# Altium schematic sheet DI.SchDoc
size A4
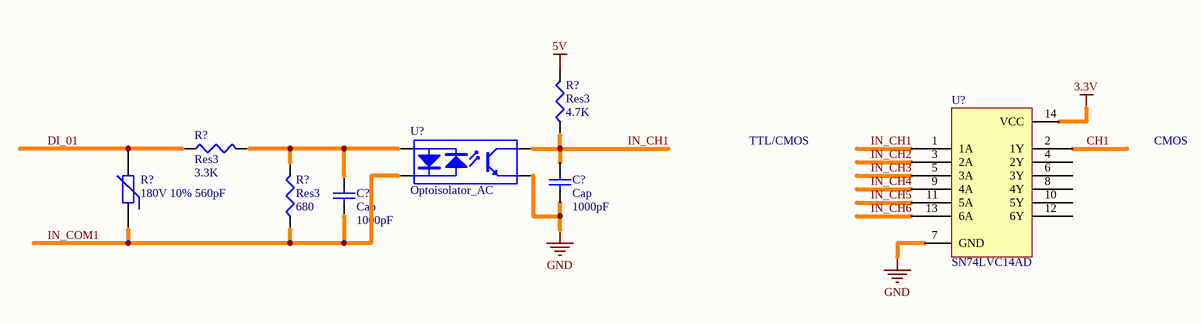
[diagram p0: DI.SchDoc]

## Parts
(Parts that share a designator on the sheet are numbered #1, #2 ... from top to bottom, then left to right.)
C?#1  Cap  value 1000pF  [RAD-0.3]
C?#2  Cap  value 1000pF  [RAD-0.3]
R?#1  Res3  value 4.7K  [J1-0603]
R?#2  Res3  value 3.3K  [J1-0603]
R?#3  180V 10% 560pF
R?#4  Res3  value 680  [J1-0603]
U?#1  SN74LVC14AD  [SOIC-14]
U?#2  Optoisolator_AC

## Nets
3.3V: U?#1.14(VCC)
5V: R?#1.2
GND: C?#1.1 U?#1.7(GND) U?#2.3(E)
CH1: U?#1.2(1Y)
DI_01: R?#2.1 R?#3.2
IN_CH1: C?#1.2 R?#1.1 U?#1.1(1A) U?#2.4(C)
IN_CH2: U?#1.3(2A)
IN_CH3: U?#1.5(3A)
IN_CH4: U?#1.9(4A)
IN_CH5: U?#1.11(5A)
IN_CH6: U?#1.13(6A)
IN_COM1: C?#2.1 R?#3.1 R?#4.1 U?#2.2(K)
NetC?#2_2: C?#2.2 R?#2.2 R?#4.2 U?#2.1(A)

Not connected (* = marked no-connect by the designer): U?#1 4(2Y) 6(3Y) 8(4Y) 10(5Y) 12(6Y)

## Notes on the sheet
- TTL/CMOS
- CMOS

## Library data of the parts
C?#1 C?#2 = Cap: Capacitor; Published: 8-Jun-2000; LatestRevisionDate: 17-Jul-2002; LatestRevisionNote: Re-released for DXP Platform.; PackageReference: RAD-0.3; Publisher: Altium Limited; PackageDescription: Radial Cap, Thru-Hole; 2 Leads; 0.3 in Pin Spacing
R?#1 R?#2 R?#4 = Res3: Resistor; Published: 8-Jun-2000; LatestRevisionDate: 29-May-2009; LatestRevisionNote: IPC-7351 Footprint Added.; PackageReference: J1-0603; Publisher: Altium Limited; PackageDescription: Chip Resistor
R?#3 = Res Varistor: Varistor (Voltage-Sensitive Resistor); Mf: Bourns; Mf P/N: 10D181K; HelpURL: http://www.bourns.com/data/global/pdfs/MOV10D.pdf
U?#1 = SN74LVC240ADBLE: SNx4LVC14A Hex Schmitt-Trigger Inverters; Mfg: TI; Mfg P/N: SN74LVC14AD; HelpURL: http://www.ti.com.cn/cn/lit/ds/symlink/sn74lvc14a.pdf
U?#2 = Optoisolator_AC: 4-Pin Phototransistor Optocoupler; HelpURL: http://www.cel.com/pdf/datasheets/ps2705a1.pdf